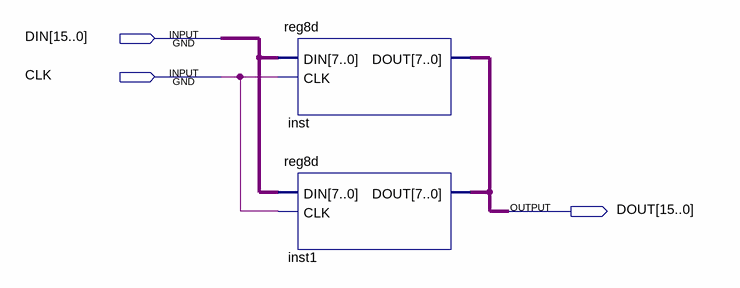
[diagram p0: schematic sheet]
// Quartus schematic reg16d.bdf as structural Verilog: 2 symbols, 3 pins
module reg16d (
  input  [15:0] DIN,
  input  CLK,
  output [15:0] DOUT
);

  reg8d inst (.DIN(DIN[7:0]), .CLK(CLK), .DOUT(DOUT[7:0]));
  reg8d inst1 (.DIN(DIN[15:8]), .CLK(CLK), .DOUT(DOUT[15:8]));
endmodule
